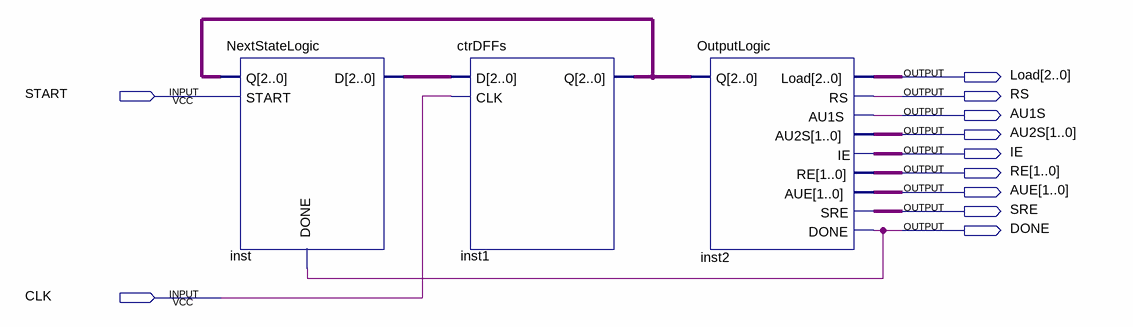
[diagram p0: schematic sheet]
// Quartus schematic Controller.bdf as structural Verilog: 3 symbols, 11 pins
module Controller (
  input  START,
  input  CLK,
  output [2:0] Load,
  output RS,
  output AU1S,
  output [1:0] AU2S,
  output IE,
  output [1:0] RE,
  output [1:0] AUE,
  output SRE,
  output DONE
);

  wire [2:0] inst1_q, inst_d;

  NextStateLogic inst (.Q(inst1_q), .START(START), .DONE(DONE), .D(inst_d));
  ctrDFFs inst1 (.D(inst_d), .CLK(CLK), .Q(inst1_q));
  OutputLogic inst2 (
    .Q(inst1_q), .Load(Load), .RS(RS), .AU1S(AU1S), .AU2S(AU2S), .IE(IE), .RE(RE), .AUE(AUE), .SRE(SRE),
    .DONE(DONE));
endmodule
